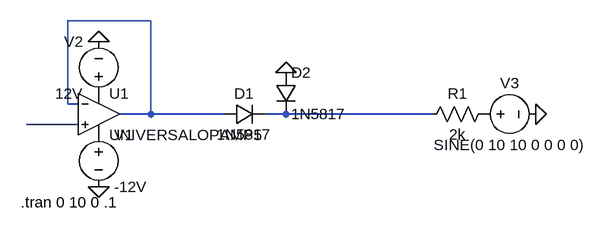
[diagram p0: schematic Protected Output Circuits Final.asc]
Protected Output Circuits Final.asc, the LTspice schematic file:
Version 4.1
SHEET 1 936 788
WIRE 256 16 128 16
WIRE 128 144 128 16
WIRE 144 144 128 144
WIRE 256 160 256 16
WIRE 256 160 208 160
WIRE 368 160 256 160
WIRE 464 160 432 160
WIRE 688 160 464 160
WIRE 144 176 64 176
FLAG 176 48 0
FLAG 176 272 0
FLAG 464 96 0
FLAG 848 160 0
DATAFLAG 768 160 ""
SYMBOL voltage 176 176 R0
WINDOW 123 0 0 Left 0
WINDOW 39 0 0 Left 0
SYMATTR InstName V1
SYMATTR Value -12V
SYMBOL voltage 176 144 R180
WINDOW 0 24 96 Left 2
WINDOW 3 24 16 Left 2
WINDOW 123 0 0 Left 0
WINDOW 39 0 0 Left 0
SYMATTR InstName V2
SYMATTR Value 12V
SYMBOL diode 368 176 R270
WINDOW 0 32 32 VTop 2
WINDOW 3 0 32 VBottom 2
SYMATTR InstName D1
SYMATTR Value 1N5817
SYMBOL OpAmps\\UniversalOpAmp5 176 160 R0
SYMATTR InstName U1
SYMBOL diode 448 96 R0
SYMATTR InstName D2
SYMATTR Value 1N5817
SYMBOL res 784 144 R90
WINDOW 0 0 56 VBottom 2
WINDOW 3 32 56 VTop 2
SYMATTR InstName R1
SYMATTR Value 2k
SYMBOL voltage 752 160 R270
WINDOW 0 32 56 VTop 2
WINDOW 3 -32 56 VBottom 2
WINDOW 123 0 0 Left 0
WINDOW 39 0 0 Left 0
SYMATTR InstName V3
SYMATTR Value SINE(0 10 10 0 0 0 0)
TEXT 56 296 Left 2 !.tran 0 10 0 .1

The netlist it stands for:
* Protected Output Circuits Final.asc
V1 P001 0 -12V
V2 P002 0 12V
D1 N001 N002 1N5817
X§U1 N003 N001 P002 P001 N001 level5 Avol=1Meg GBW=10Meg Phimargin=45 SlewPos=10Meg SlewNeg=10Meg En=0 Enk=0 In=0 Ink=0 Rcm=500Meg Ccm=1p Rdiff=500k Cdiff=2p Ro=1k Vos=0 Ibp=2n Ibn=1n Iq=1m Rail=0 Ilimit=25m  ; UNIVERSALOPAMP5, pins In+ In- V+ V- OUT
D2 0 N002 1N5817
R1 P003 N002 2k
V3 P003 0 SINE(0 10 10 0 0 0 0)
.model D D
.lib standard.dio
.tran 0 10 0 .1
.backanno
.end